# EAGLE design ToolChanger_RevA (EAGLE 7.6.0)

## Sheet 1 of 2
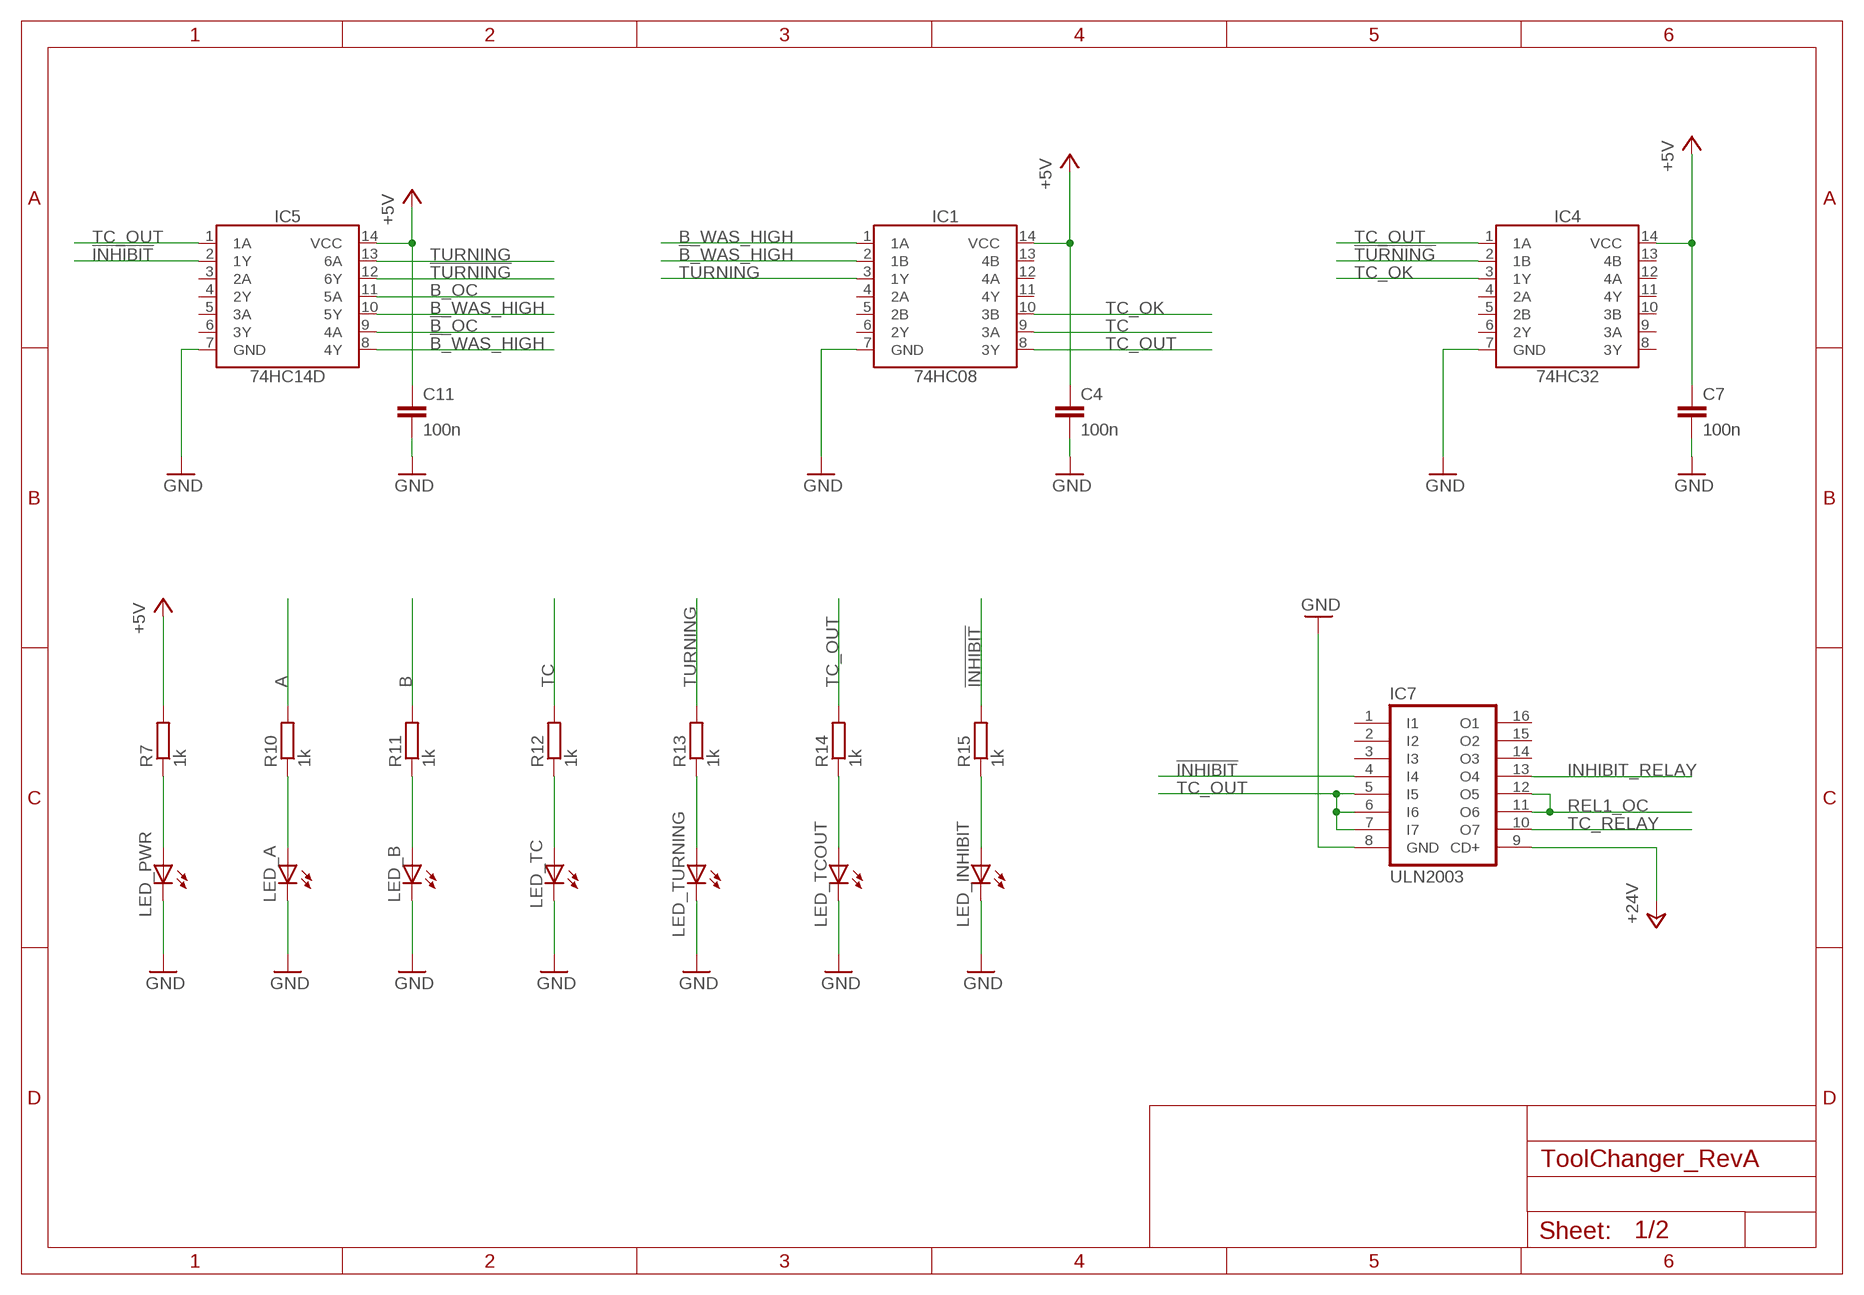
[diagram p0: schematic, sheet 1]

### Parts
C4  100n  CC0805  [C0805]
C7  100n  CC0805  [C0805]
C11  100n  CC0805  [C0805]
IC1  74HC08  [SO14]
IC4  74HC32  [SO14]
IC5  74HC14D  [SO14]
IC7  ULN2003  [SO16]
LED_A  LED0805_NB  [LED0805_NOBOARDER]
LED_B  LED0805_NB  [LED0805_NOBOARDER]
LED_INHIBIT  LED0805_NB  [LED0805_NOBOARDER]
LED_PWR  LED0805_NB  [LED0805_NOBOARDER]
LED_TC  LED0805_NB  [LED0805_NOBOARDER]
LED_TCOUT  LED0805_NB  [LED0805_NOBOARDER]
LED_TURNING  LED0805_NB  [LED0805_NOBOARDER]
R7  1k  RESISTORR0805  [R0805]
R10  1k  RESISTORR0805  [R0805]
R11  1k  RESISTORR0805  [R0805]
R12  1k  RESISTORR0805  [R0805]
R13  1k  RESISTORR0805  [R0805]
R14  1k  RESISTORR0805  [R0805]
R15  1k  RESISTORR0805  [R0805]

### Nets
!B!_OC: IC5.9(4A) ; also sheet 2
!B!_WAS_HIGH: IC1.2(1B) IC5.8(4Y)
!INHIBIT!: IC5.2(1Y) IC7.4(I4) R15.2
!TURNING!: IC4.2(1B) IC5.12(6Y)
+5V [+5v]: C4.1 C7.1 C11.1 IC1.14(VCC) IC4.14(VCC) IC5.14(VCC) R7.2 ; also sheet 2
+24V [+5v]: IC7.9(CD+) ; also sheet 2
A: R10.2 ; also sheet 2
B: R11.2 ; also sheet 2
B_OC: IC5.11(5A) ; also sheet 2
B_WAS_HIGH: IC1.1(1A) IC5.10(5Y)
GND: C4.2 C7.2 C11.2 IC1.7(GND) IC4.7(GND) IC5.7(GND) IC7.8(GND) LED_A.C LED_B.C LED_INHIBIT.C LED_PWR.C LED_TC.C LED_TCOUT.C LED_TURNING.C ; also sheet 2
INHIBIT_RELAY: IC7.13(O4) ; also sheet 2
N$1: LED_PWR.A R7.1
N$2: LED_A.A R10.1
N$4: LED_B.A R11.1
N$5: LED_TC.A R12.1
N$6: LED_TURNING.A R13.1
N$7: LED_TCOUT.A R14.1
N$8: LED_INHIBIT.A R15.1
REL1_OC: IC7.11(O6) IC7.12(O5) ; also sheet 2
TC: IC1.9(3A) R12.2 ; also sheet 2
TC_OK: IC1.10(3B) IC4.3(1Y)
TC_OUT: IC1.8(3Y) IC4.1(1A) IC5.1(1A) IC7.5(I5) IC7.6(I6) IC7.7(I7) R14.2
TC_RELAY: IC7.10(O7) ; also sheet 2
TURNING: IC1.3(1Y) IC5.13(6A) R13.2
Unconnected: IC1.4(2A) IC1.5(2B) IC1.6(2Y) IC1.11(4Y) IC1.12(4A) IC1.13(4B) IC4.4(2A) IC4.5(2B) IC4.6(2Y) IC4.8(3Y) IC4.9(3A) IC4.10(3B) IC4.11(4Y) IC4.12(4A) IC4.13(4B) IC5.3(2A) IC5.4(2Y) IC5.5(3A) IC5.6(3Y) IC7.1(I1) IC7.2(I2) IC7.3(I3) IC7.14(O3) IC7.15(O2) IC7.16(O1)

## Sheet 2 of 2
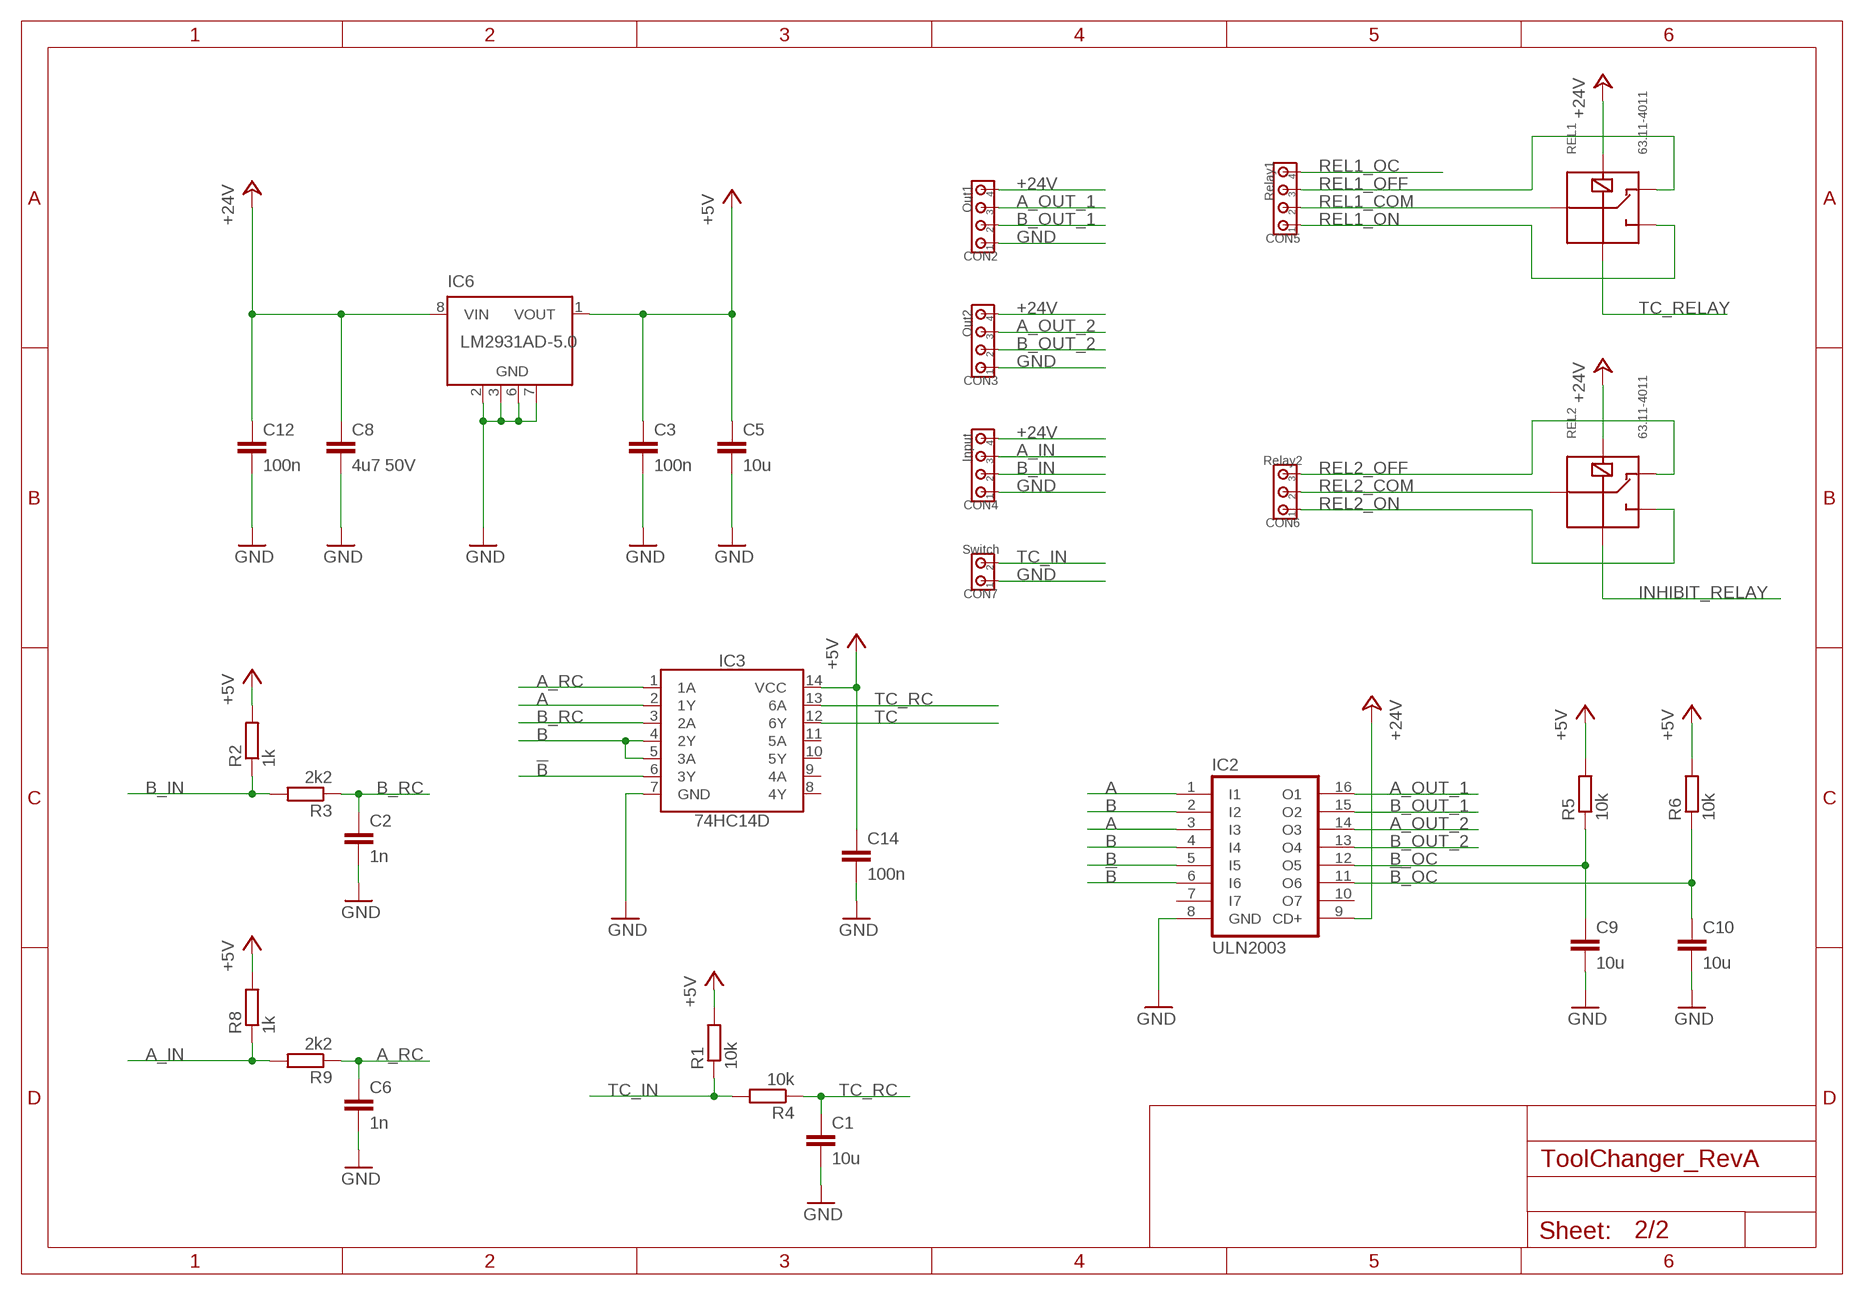
[diagram p1: schematic, sheet 2]

### Parts
C1  10u  CC0805  [C0805]
C2  1n  CC0805  [C0805]
C3  100n  CC0805  [C0805]
C5  10u  CC0805  [C0805]
C6  1n  CC0805  [C0805]
C8  4u7 50V  CC1206  [C1206]
C9  10u  CC0805  [C0805]
C10  10u  CC0805  [C0805]
C12  100n  CC0805  [C0805]
C14  100n  CC0805  [C0805]
CON2  Out1  CON_4X3.5MM  [3.5MM_4X]
CON3  Out2  CON_4X3.5MM  [3.5MM_4X]
CON4  Input  CON_4X3.5MM  [3.5MM_4X]
CON5  Relay1  CON_4X200MIL  [200MIL_4X]
CON6  Relay2  CON_3X200MIL  [200MIL_3X]
CON7  Switch  CON_2X3.5MM  [3.5MM_2X]
IC2  ULN2003  [SO16]
IC3  74HC14D  [SO14]
IC6  LM2931AD-5.0  [SOIC8]
R1  10k  RESISTORR0805  [R0805]
R2  1k  RESISTORR0805  [R0805]
R3  2k2  RESISTORR0805  [R0805]
R4  10k  RESISTORR0805  [R0805]
R5  10k  RESISTORR0805  [R0805]
R6  10k  RESISTORR0805  [R0805]
R8  1k  RESISTORR0805  [R0805]
R9  2k2  RESISTORR0805  [R0805]
REL1  63.11-4011  [G5LE]
REL2  63.11-4011  [G5LE]

### Nets
!B!: IC2.6(I6) IC3.6(3Y)
!B!_OC: C10.1 IC2.11(O6) R6.1 ; also sheet 1
+5V [+5v]: C3.1 C5.1 C14.1 IC3.14(VCC) IC6.1(VOUT) R1.2 R2.2 R5.2 R6.2 R8.2 ; also sheet 1
+24V [+5v]: C8.1 C12.1 CON2.4 CON3.4 CON4.4 IC2.9(CD+) IC6.8(VIN) REL1.2 REL2.2 ; also sheet 1
A: IC2.1(I1) IC2.3(I3) IC3.2(1Y) ; also sheet 1
A_IN: CON4.3 R8.1 R9.2
A_OUT_1: CON2.3 IC2.16(O1)
A_OUT_2: CON3.3 IC2.14(O3)
A_RC: C6.1 IC3.1(1A) R9.1
B: IC2.2(I2) IC2.4(I4) IC2.5(I5) IC3.4(2Y) IC3.5(3A) ; also sheet 1
B_IN: CON4.2 R2.1 R3.2
B_OC: C9.1 IC2.12(O5) R5.1 ; also sheet 1
B_OUT_1: CON2.2 IC2.15(O2)
B_OUT_2: CON3.2 IC2.13(O4)
B_RC: C2.1 IC3.3(2A) R3.1
GND: C1.2 C2.2 C3.2 C5.2 C6.2 C8.2 C9.2 C10.2 C12.2 C14.2 CON2.1 CON3.1 CON4.1 CON7.1 IC2.8(GND) IC3.7(GND) IC6.2(GND) IC6.3(GND) IC6.6(GND) IC6.7(GND) ; also sheet 1
INHIBIT_RELAY: REL2.1 ; also sheet 1
REL1_COM: CON5.2 REL1.COM
REL1_OC: CON5.4 ; also sheet 1
REL1_OFF: CON5.3 REL1.O
REL1_ON: CON5.1 REL1.C
REL2_COM: CON6.2 REL2.COM
REL2_OFF: CON6.3 REL2.O
REL2_ON: CON6.1 REL2.C
TC: IC3.12(6Y) ; also sheet 1
TC_IN: CON7.2 R1.1 R4.2
TC_RC: C1.1 IC3.13(6A) R4.1
TC_RELAY: REL1.1 ; also sheet 1
Unconnected: IC2.7(I7) IC2.10(O7) IC3.8(4Y) IC3.9(4A) IC3.10(5Y) IC3.11(5A)

## Library data of the parts
C1-C12 C14 = 00Capacitor:C: Capacitor
CON2-CON5 = 00Connector:CON_4X: 4-pin header
CON6 = 00Connector:CON_3X: 3-pin header
CON7 = 00Connector:CON_2X: 2-pin header
IC1 = 00Logic:74HC08: Quad 2-input AND gate
IC2 IC7 = 00Transistor:ULN2003: Seven Darlington array
IC3 IC5 = 00Logic:74HC14: Hex Inverter Schmitt Trigger
IC4 = 00Logic:74HC32: Quad 2-input OR gate
IC6 = 00VoltageRegulator:LM2931*
LED_A LED_B LED_INHIBIT LED_PWR LED_TC LED_TCOUT LED_TURNING = 00Display:LED: LED
R1-R15 = 00Resistor:RESISTOR: RESISTOR, European symbol
REL1 REL2 = 00Switch:63.11-4011: SPDT Relay

## Net classes
1 mains: width 0.813 mm, drill 0.6 mm, clearance 0.813 mm to class 0, clearance 0.813 mm
2 relay: width 0.813 mm, drill 0.6 mm, clearance 0.61 mm to class 0, clearance 0.61 mm to class 1
3 12v: width 0.61 mm, drill 0.6 mm, clearance 0.406 mm to class 0, clearance 0.406 mm to class 1, clearance 0.406 mm to class 2, clearance 0.406 mm
4 analog: width 0.406 mm, drill 0.6 mm, clearance 0.406 mm to class 0, clearance 0.406 mm to class 1, clearance 0.406 mm to class 2, clearance 0.406 mm to class 3, clearance 0.406 mm
5 +5v: width 0.61 mm, drill 0.6 mm, clearance 0.254 mm to class 0, clearance 0.254 mm to class 1, clearance 0.254 mm to class 2, clearance 0.254 mm to class 3, clearance 0.254 mm to class 4, clearance 0.254 mm

## Board
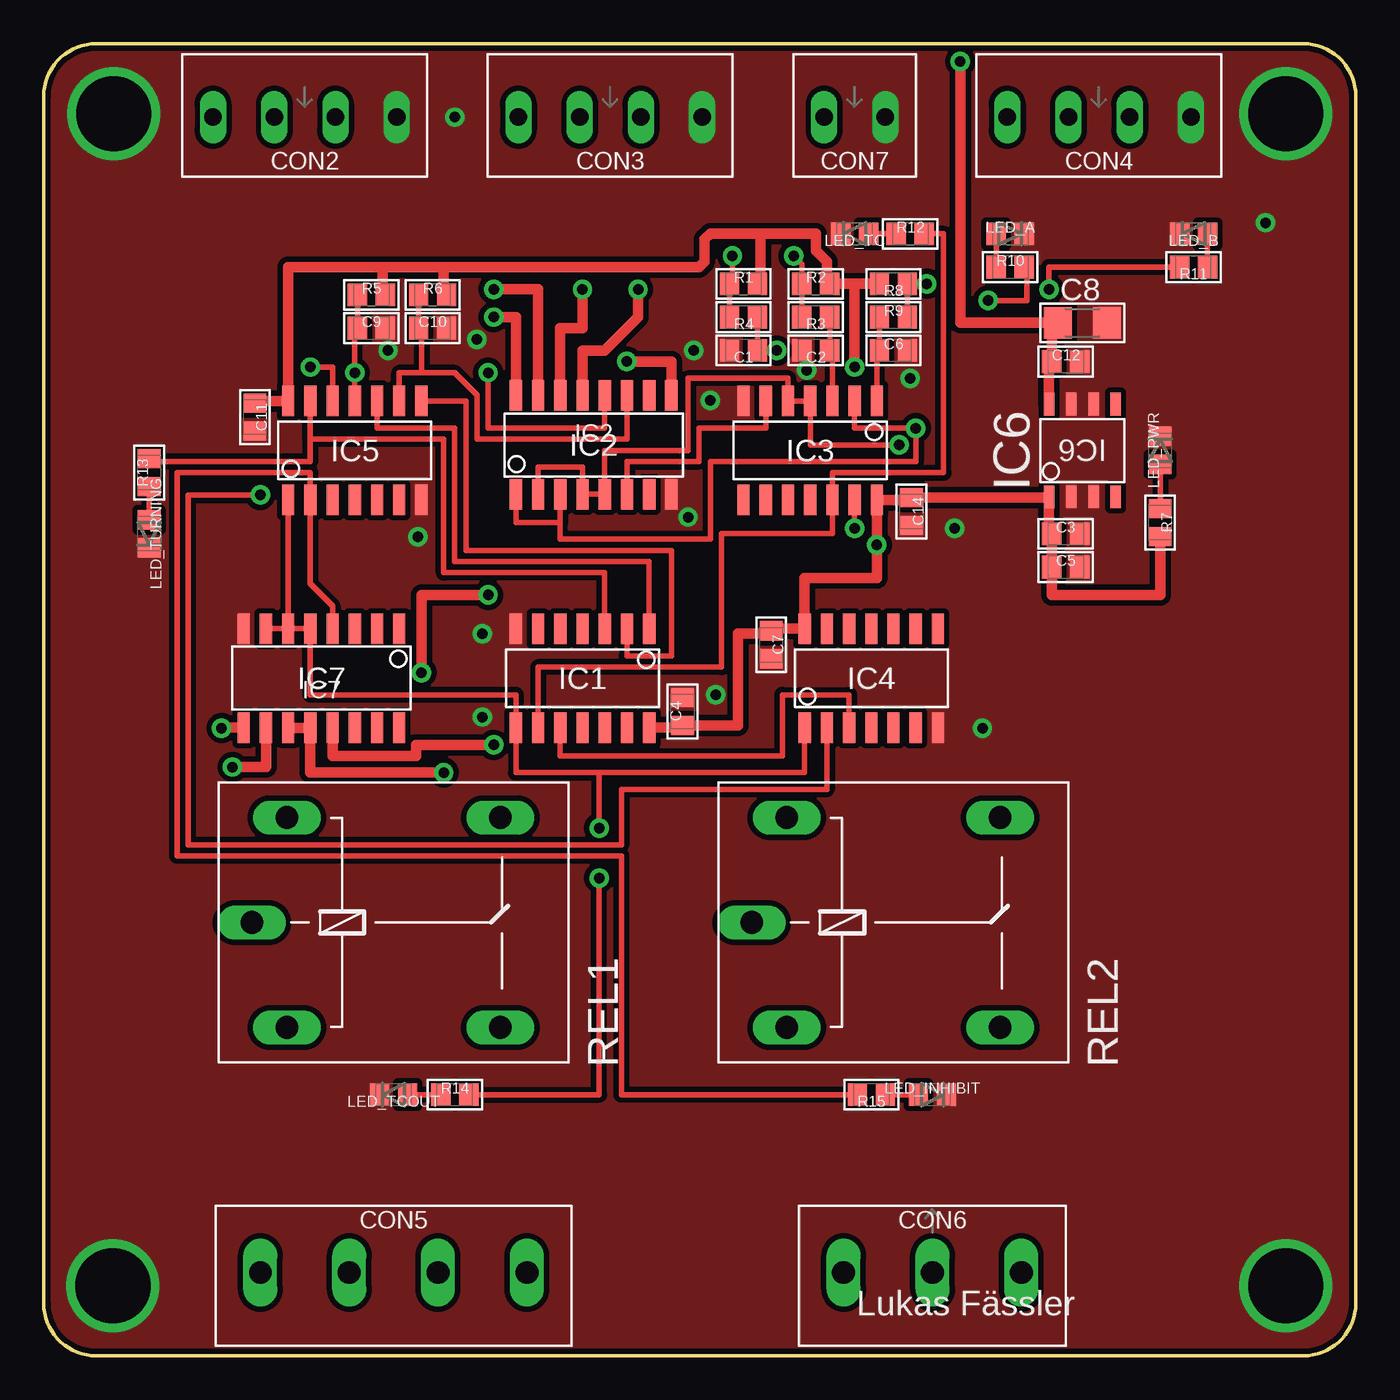
[diagram p2: board, top side]
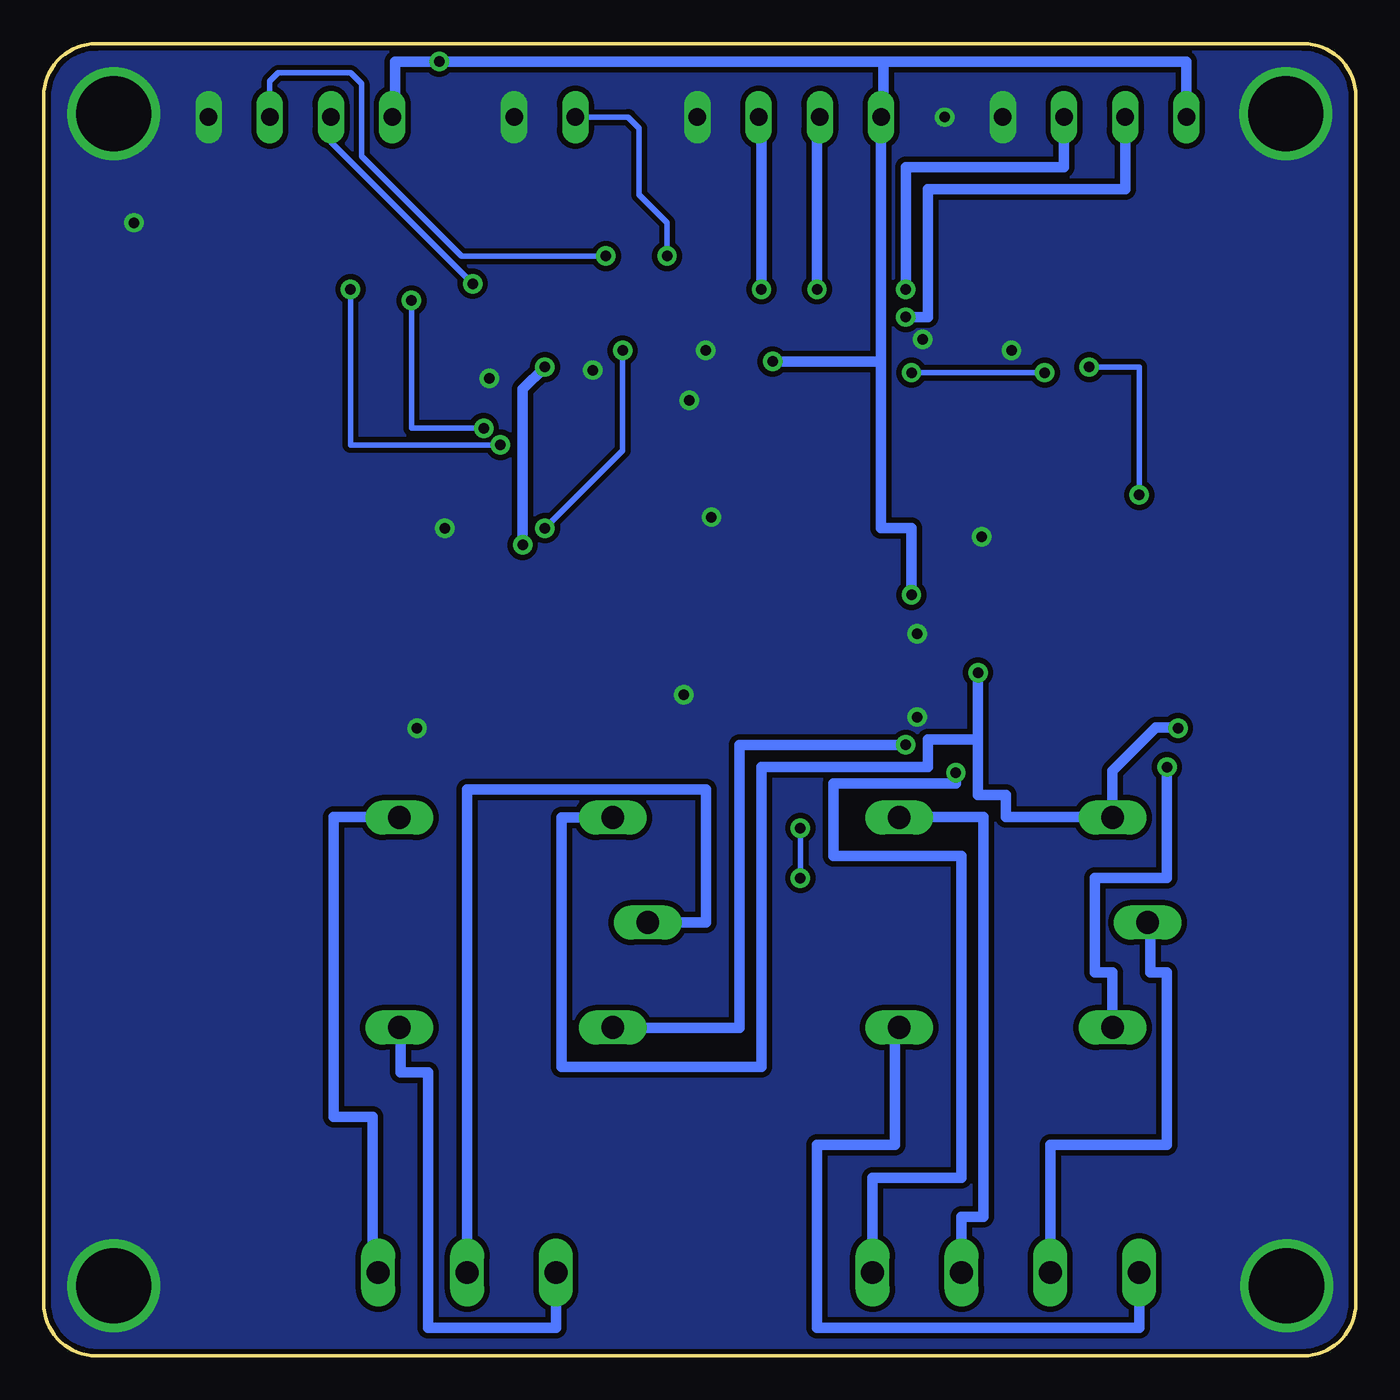
[diagram p3: board, bottom side, seen from below]

Size 75 x 75 mm. Coordinates in mm from the lower left corner, seen from the top.
Outline: 0,72 arc-90 3,75 72,75 arc-90 75,72 75,3 arc-90 72,0 3,0 arc-90 0,3 0,72
Copper layers (1*16): Top 0.035mm / dielectric 1.5mm / Bottom 0.035mm
Design rules "LPKF_Compatible": minimum track width 8mil, minimum drill 23mil, track to track 8mil, track to pad 8mil, pad to pad 8mil, via to via 8mil, smd to smd 0mil, copper to edge 10mil, drill to drill 10mil, minimum pad ring 10mil, minimum via ring 10mil, stop-mask expansion 2mil, vias tented up to drill 25mil, thermal gap 10mil

### Footprints (pad centres in the part's own frame; a part is rotated, then mirrored left to right if it is on the bottom)
C0805 = smd 1.1 x 1.3: 1 -0.8,0; 2 0.8,0
C1206 = smd 1.6 x 1.8: 1 -1.4,0; 2 1.4,0
3.5MM_4X = drill 1 long: 1 -5.25,0; 2 -1.75,0; 3 1.75,0; 4 5.25,0
200MIL_4X = drill 1.3 long: 1 -7.62,0; 2 -2.54,0; 3 2.54,0; 4 7.62,0
200MIL_3X = drill 1.3 long: 1 -5.08,0; 2 0,0; 3 5.08,0
3.5MM_2X = drill 1 long: 1 -1.75,0; 2 1.75,0
SO14 = smd 0.7 x 1.75: 1 -3.81,-2.825; 2 -2.54,-2.825; 3 -1.27,-2.825; 4 0,-2.825; 5 1.27,-2.825; 6 2.54,-2.825; 7 3.81,-2.825; 8 3.81,2.825; 9 2.54,2.825; 10 1.27,2.825; 11 0,2.825; 12 -1.27,2.825; 13 -2.54,2.825; 14 -3.81,2.825
SO16 = smd 0.7 x 1.75: 1 -4.445,-2.825; 2 -3.175,-2.825; 3 -1.905,-2.825; 4 -0.635,-2.825; 5 0.635,-2.825; 6 1.905,-2.825; 7 3.175,-2.825; 8 4.445,-2.825; 9 4.445,2.825; 10 3.175,2.825; 11 1.905,2.825; 12 0.635,2.825; 13 -0.635,2.825; 14 -1.905,2.825; 15 -3.175,2.825; 16 -4.445,2.825
SOIC8 = smd 1.3 x 0.6: 1 -2.65,1.905; 2 -2.65,0.635; 3 -2.65,-0.635; 4 -2.65,-1.905; 5 2.65,-1.905; 6 2.65,-0.635; 7 2.65,0.635; 8 2.65,1.905
LED0805_NOBOARDER = smd 1.1 x 1.3: A -0.8,0; C 0.8,0
R0805 = smd 1.1 x 1.3: 1 -0.8,0; 2 0.8,0
G5LE = drill 1.3 long: 1 -6.1,-6; 2 -6.1,6; C 6.1,-6; COM -8.1,0; O 6.1,6

### Placement (x,y rotation side)
C1  40.01,57.47 180 top
C2  44.13,57.47 180 top
C3  58.42,46.99 0 top
C4  36.51,36.83 90 top
C5  58.42,45.09 0 top
C6  48.58,57.47 0 top
C7  41.59,40.64 270 top
C8  59.37,59.05 0 top
C9  18.73,58.74 0 top
C10  22.23,58.74 0 top
C11  12.06,53.66 270 top
C12  58.42,56.83 0 top
C14  49.6,48.26 270 top
CON2  14.92,70.8 180 top
CON3  32.38,70.8 180 top
CON4  60.33,70.8 180 top
CON5  20,4.76 0 top
CON6  50.8,4.76 0 top
CON7  46.35,70.8 180 top
IC1  30.8,38.73 180 top
IC2  31.43,52.07 0 top
IC3  43.81,51.75 180 top
IC4  47.31,38.73 0 top
IC5  17.78,51.75 0 top
IC6  59.37,51.75 90 top
IC7  15.88,38.73 180 top
LED_A  55.24,64.14 0 top
LED_B  65.72,64.14 180 top
LED_INHIBIT  50.8,14.92 0 top
LED_PWR  63.82,51.75 90 top
LED_TC  46.35,64.14 180 top
LED_TCOUT  20,14.92 180 top
LED_TURNING  6.03,46.99 270 top
R1  40.01,61.28 0 top
R2  44.13,61.28 0 top
R3  44.13,59.37 180 top
R4  40.01,59.37 180 top
R5  18.73,60.64 0 top
R6  22.23,60.64 0 top
R7  63.82,47.62 270 top
R8  48.58,61.28 180 top
R9  48.58,59.37 0 top
R10  55.24,62.23 0 top
R11  65.72,62.23 180 top
R12  49.53,64.14 0 top
R13  6.03,50.48 90 top
R14  23.5,14.92 0 top
R15  47.31,14.92 180 top
REL1  20,24.77 0 top
REL2  48.58,24.77 0 top

### Tracks (layer width: path | path; a pad name or v marks a point on that pad's centre or on a via)
!B!
  Top 0.305: IC3.6 41.27,53.02 37.47,53.02 37.47,51.12 33.34,51.12 IC2.6
!B!_OC
  Top 0.305: IC5.9 20.32,56.2 21.59,56.2 | 21.59,56.2 23.5,56.2 24.77,54.93 24.77,52.39 33.34,52.39 IC2.11 | R6.1 C10.1 21.59,58.57 21.59,56.2
!B!_WAS_HIGH
  Top 0.305: IC1.2 33.34,40.01 35.88,40.01 35.88,46.04 24.13,46.04 24.13,54.58 IC5.8
!INHIBIT!
  Top 0.305: R15.2 33.02,14.92 33.02,28.57 7.62,28.57 7.62,50.48 15.24,50.48 IC5.2 15.24,44.13 16.51,42.86 IC7.4
!TURNING!  (via drill 0.6)
  Top 0.305: IC4.2 44.77,32.38 33.02,32.38 33.02,29.21 8.26,29.21 8.26,49.21 v12.38,49.21 | IC5.12 16.51,56.52 v15.24,56.52
  Bottom 0.305: v12.38,49.21 12.38,56.52 v15.24,56.52
+5V  (via drill 0.6)
  Top 0.61: IC1.14 36.51,35.91 C4.1 39.69,36.03 39.69,41.27 41.59,41.27 C7.1 41.59,41.56 IC4.14 43.5,44.45 47.62,44.45 v47.62,46.35 IC3.14 49.45,48.93 49.59,49.06 C14.1 57.42,49.06 IC6.1 | C11.1 12.06,54.58 IC5.14 13.97,62.23 19.37,62.23 | IC6.1 57.47,47.14 C3.1 C5.1 57.62,43.5 63.82,43.5 R7.2 | 57.47,49.05 IC6.1 | R8.2 46.35,61.28 | 46.35,61.28 R2.2 44.77,61.44 44.77,62.55 44.13,63.18 44.13,64.14 40.96,64.14 | 46.35,61.28 v46.35,56.52 | 40.96,64.14 38.1,64.14 37.78,63.82 37.78,62.55 37.47,62.23 22.86,62.23 | 19.37,62.23 22.86,62.23 | R1.2 40.96,61.43 40.96,64.14 | 19.37,60.49 19.37,60.64 | 19.37,60.64 19.37,62.23 | R6.2 22.86,60.64 22.86,62.23 | 19.37,60.64 R5.2
  Bottom 0.61: v46.35,56.52 47.62,55.24 v47.62,46.35
+24V  (via drill 0.6)
  Top 0.61: v21.59,39.05 21.59,43.5 v25.4,43.5 | IC6.8 57.47,56.68 C12.1 57.62,58.7 C8.1 52.39,59.05 v52.39,73.98 | IC2.9 35.88,56.83 v33.34,56.83 | IC7.9 10.19,35.91 v10.16,35.88
  Bottom 0.61: CON2.4 9.67,73.98 26.99,73.98 | 26.99,73.98 v52.39,73.98 54.93,73.98 54.93,70.8 CON4.4 54.93,70.66 | 26.99,73.98 26.99,70.8 CON3.4 27.14,56.83 | 27.14,56.83 27.14,47.31 25.4,47.31 v25.4,43.5 | REL1.2 13.9,30.8 | 13.9,30.8 20,30.8 20,32.07 21.59,32.07 21.59,35.24 | 21.59,35.24 v21.59,39.05 | 21.59,35.24 24.45,35.24 24.45,33.66 33.97,33.66 33.97,16.51 45.4,16.51 45.4,30.77 REL2.2 | v33.34,56.83 27.14,56.83 | 13.9,30.8 13.9,33.44 IC7.9 10.19,35.91 v10.16,35.88
A  (via drill 0.6)
  Top 0.305: IC3.2 46.35,53.02 v49.85,53.02 49.85,51.12 38.1,51.12 38.1,46.67 29.53,46.67 29.53,47.62 | R10.2 56.2,62.23 56.2,60.33 v53.98,60.33 | IC2.3 29.53,47.62 | 29.53,47.62 26.99,47.62 IC2.1
  Bottom 0.305: v49.85,53.02 53.98,53.02 v53.98,60.33
A_IN  (via drill 0.6)
  Top 0.305: R9.2 R8.1 v50.48,61.28
  Bottom 0.305: CON4.3 58.58,69.37 v50.48,61.28
A_OUT_1  (via drill 0.6)
  Top 0.61: v25.72,59.37 26.99,59.37 IC2.16
  Bottom 0.61: CON2.3 13.17,66.67 24.45,66.67 24.45,59.37 v25.72,59.37
A_OUT_2  (via drill 0.6)
  Top 0.61: v30.8,60.96 30.8,58.74 29.53,58.74 IC2.14
  Bottom 0.61: CON3.3 30.64,70.65 30.8,70.48 v30.8,60.96
A_RC
  Top 0.305: R9.1 C6.1 47.62,57.31 IC3.1
B  (via drill 0.6)
  Top 0.305: v48.9,52.07 43.81,52.07 IC3.4 IC3.5 42.55,55.88 36.83,55.88 36.83,51.75 32.07,51.75 IC2.5 IC2.4 30.8,50.8 28.26,50.8 IC2.2 | R11.2 57.47,62.23 v57.47,60.96
  Bottom 0.305: v48.9,52.07 57.47,52.07 v57.47,60.96
B_IN  (via drill 0.6)
  Top 0.305: R3.2 R2.1 43.33,62.4 v42.86,62.87
  Bottom 0.305: CON4.2 62.08,72.86 61.59,73.34 57.47,73.34 56.83,72.71 56.83,68.58 51.12,62.87 v42.86,62.87
B_OC  (via drill 0.6)
  Top 0.305: R5.1 C9.1 17.93,58.57 17.78,58.42 v17.78,56.2 IC5.11 17.78,54.29 | v25.4,56.2 25.4,53.02 32.07,53.02 IC2.12
  Bottom 0.305: v25.4,56.2 v17.78,56.2
B_OUT_1  (via drill 0.6)
  Top 0.61: v25.72,60.96 28.26,60.96 IC2.15
  Bottom 0.61: CON2.2 16.67,67.94 25.72,67.94 v25.72,60.96
B_OUT_2  (via drill 0.6)
  Top 0.61: v33.97,60.96 33.97,59.37 32.07,57.47 30.8,57.47 IC2.13
  Bottom 0.61: CON3.2 33.97,70.8 v33.97,60.96
B_RC
  Top 0.305: R3.1 C2.1 45.09,57.47 IC3.3
B_WAS_HIGH
  Top 0.305: IC1.1 34.61,45.4 23.5,45.4 23.5,53.02 19.05,53.02 IC5.10
GND  (via drill 0.6, 4.3 pad 5)
  other vias: 43.61,56.34 21.39,46.81 4,71 71,71 71,4 3.95,4 25.08,41.27 38.42,37.78 25.08,36.51 19.68,57.47 24.77,58.1 37.15,57.47 38.1,54.61 52.07,47.31 49.53,55.88 53.66,35.88 23.5,70.8 69.85,64.77 36.83,47.94
  pour Bottom (isolate 0.305, rank 2, no thermals): 0,72 0,3 arc90 3.95,0 72,0 arc90 75,3 75,72.48 arc90 72,75 3,75 arc90
  pour Top (isolate 0.305, rank 2, no thermals): 0,72 0,3 arc90 3.95,0 72,0 arc90 75,3 75,72.48 arc90 72,75 3,75 arc90
INHIBIT_RELAY  (via drill 0.6)
  Top 0.61: v25.72,34.92 21.27,34.92 21.27,34.29 16.51,34.29 IC7.13
  Bottom 0.61: REL2.1 42.48,18.73 35.24,18.73 35.24,34.92 v25.72,34.92
N$1
  Top 0.305: LED_PWR.A R7.1
N$2
  Top 0.305: LED_A.A R10.1
N$4
  Top 0.305: LED_B.A R11.1
N$5
  Top 0.305: LED_TC.A R12.1
N$6
  Top 0.305: R13.1 LED_TURNING.A
N$7
  Top 0.305: R14.1 LED_TCOUT.A
N$8
  Top 0.305: LED_INHIBIT.A R15.1
REL1_COM
  Bottom 0.61: CON5.2 17.46,12.06 10.79,12.06 10.79,21.91 11.75,21.91 11.75,24.77 REL1.COM
REL1_OC  (via drill 0.6)
  Top 0.61: v22.86,33.34 15.24,33.34 15.24,35.88 | IC7.12 15.24,35.88 | 15.24,35.88 14,35.88 IC7.11
  Bottom 0.61: CON5.4 27.62,10.16 22.54,10.16 22.54,28.57 29.84,28.57 29.84,32.7 22.86,32.7 v22.86,33.34
REL1_OFF
  Bottom 0.61: REL1.O 26.1,30.8 21.27,30.8 21.27,7.94 22.54,7.94 CON5.3
REL1_ON
  Bottom 0.61: CON5.1 12.38,1.59 30.8,1.59 30.8,12.06 26.35,12.06 26.35,18.77 REL1.C
REL2_COM
  Bottom 0.61: CON6.2 50.8,32.38 37.15,32.38 37.15,24.77 REL2.COM
REL2_OFF
  Bottom 0.61: REL2.O 54.68,30.8 58.42,30.8 58.42,13.65 56.2,13.65 56.2,4.76 CON6.3
REL2_ON
  Bottom 0.61: CON6.1 45.72,1.59 53.02,1.59 53.02,16.19 54.61,16.19 54.61,18.77 REL2.C
TC
  Top 0.305: IC1.9 28.26,39.37 38.73,39.37 38.73,46.99 45.09,46.99 IC3.12 45.09,50.48 51.44,50.48 51.44,64.14 R12.2
TC_IN  (via drill 0.6)
  Top 0.305: R4.2 R1.1 39.37,61.44 v39.37,62.87
  Bottom 0.305: CON7.2 41.59,70.8 40.96,70.17 40.96,66.36 39.37,64.77 v39.37,62.87
TC_OK
  Top 0.305: IC1.10 29.53,34.29 42.23,34.29 42.23,37.78 46.04,37.78 IC4.3
TC_OUT  (via drill 0.6)
  Top 0.305: 31.75,33.34 26.99,33.34 IC1.8 26.99,37.78 15.24,37.78 IC7.5 IC7.6 | 31.75,33.34 43.5,33.34 IC4.1 | 31.75,33.34 v31.75,30.16 | R14.2 31.75,14.92 v31.75,27.3 | IC5.1 IC7.6 | IC7.6 IC7.7
  Bottom 0.305: v31.75,30.16 v31.75,27.3
TC_RC  (via drill 0.6)
  Top 0.305: R4.1 C1.1 v41.91,57.47 | IC3.13 v46.35,47.31
  Bottom 0.305: v41.91,57.47 41.91,51.75 v46.35,47.31
TC_RELAY  (via drill 0.6)
  Top 0.61: IC7.10 12.7,33.66 v10.79,33.66
  Bottom 0.61: REL1.1 13.9,21.91 14.92,21.91 14.92,27.3 10.79,27.3 v10.79,33.66
TURNING
  Top 0.305: IC1.3 32.07,44.77 22.86,44.77 22.86,52.39 15.24,52.39 | 15.24,52.39 IC5.13 | 15.24,52.39 15.24,51.12 6.03,51.12 R13.2

### Text on the board
tPlace: Lukas Fässler
tText: + | A | B | - | + | A | B | - | Switch | + | A | B | - | Output 1 | Output 2 | Input | Power | Turning | Tool Changer | Lukas Fässler 2020 | soldernerd.com | Tool Change | Spindle Stop | On | Com | Off | OC | On | Com | Off